# EAGLE design LME49810_Datasheet_DIYAudio (EAGLE 5.07)
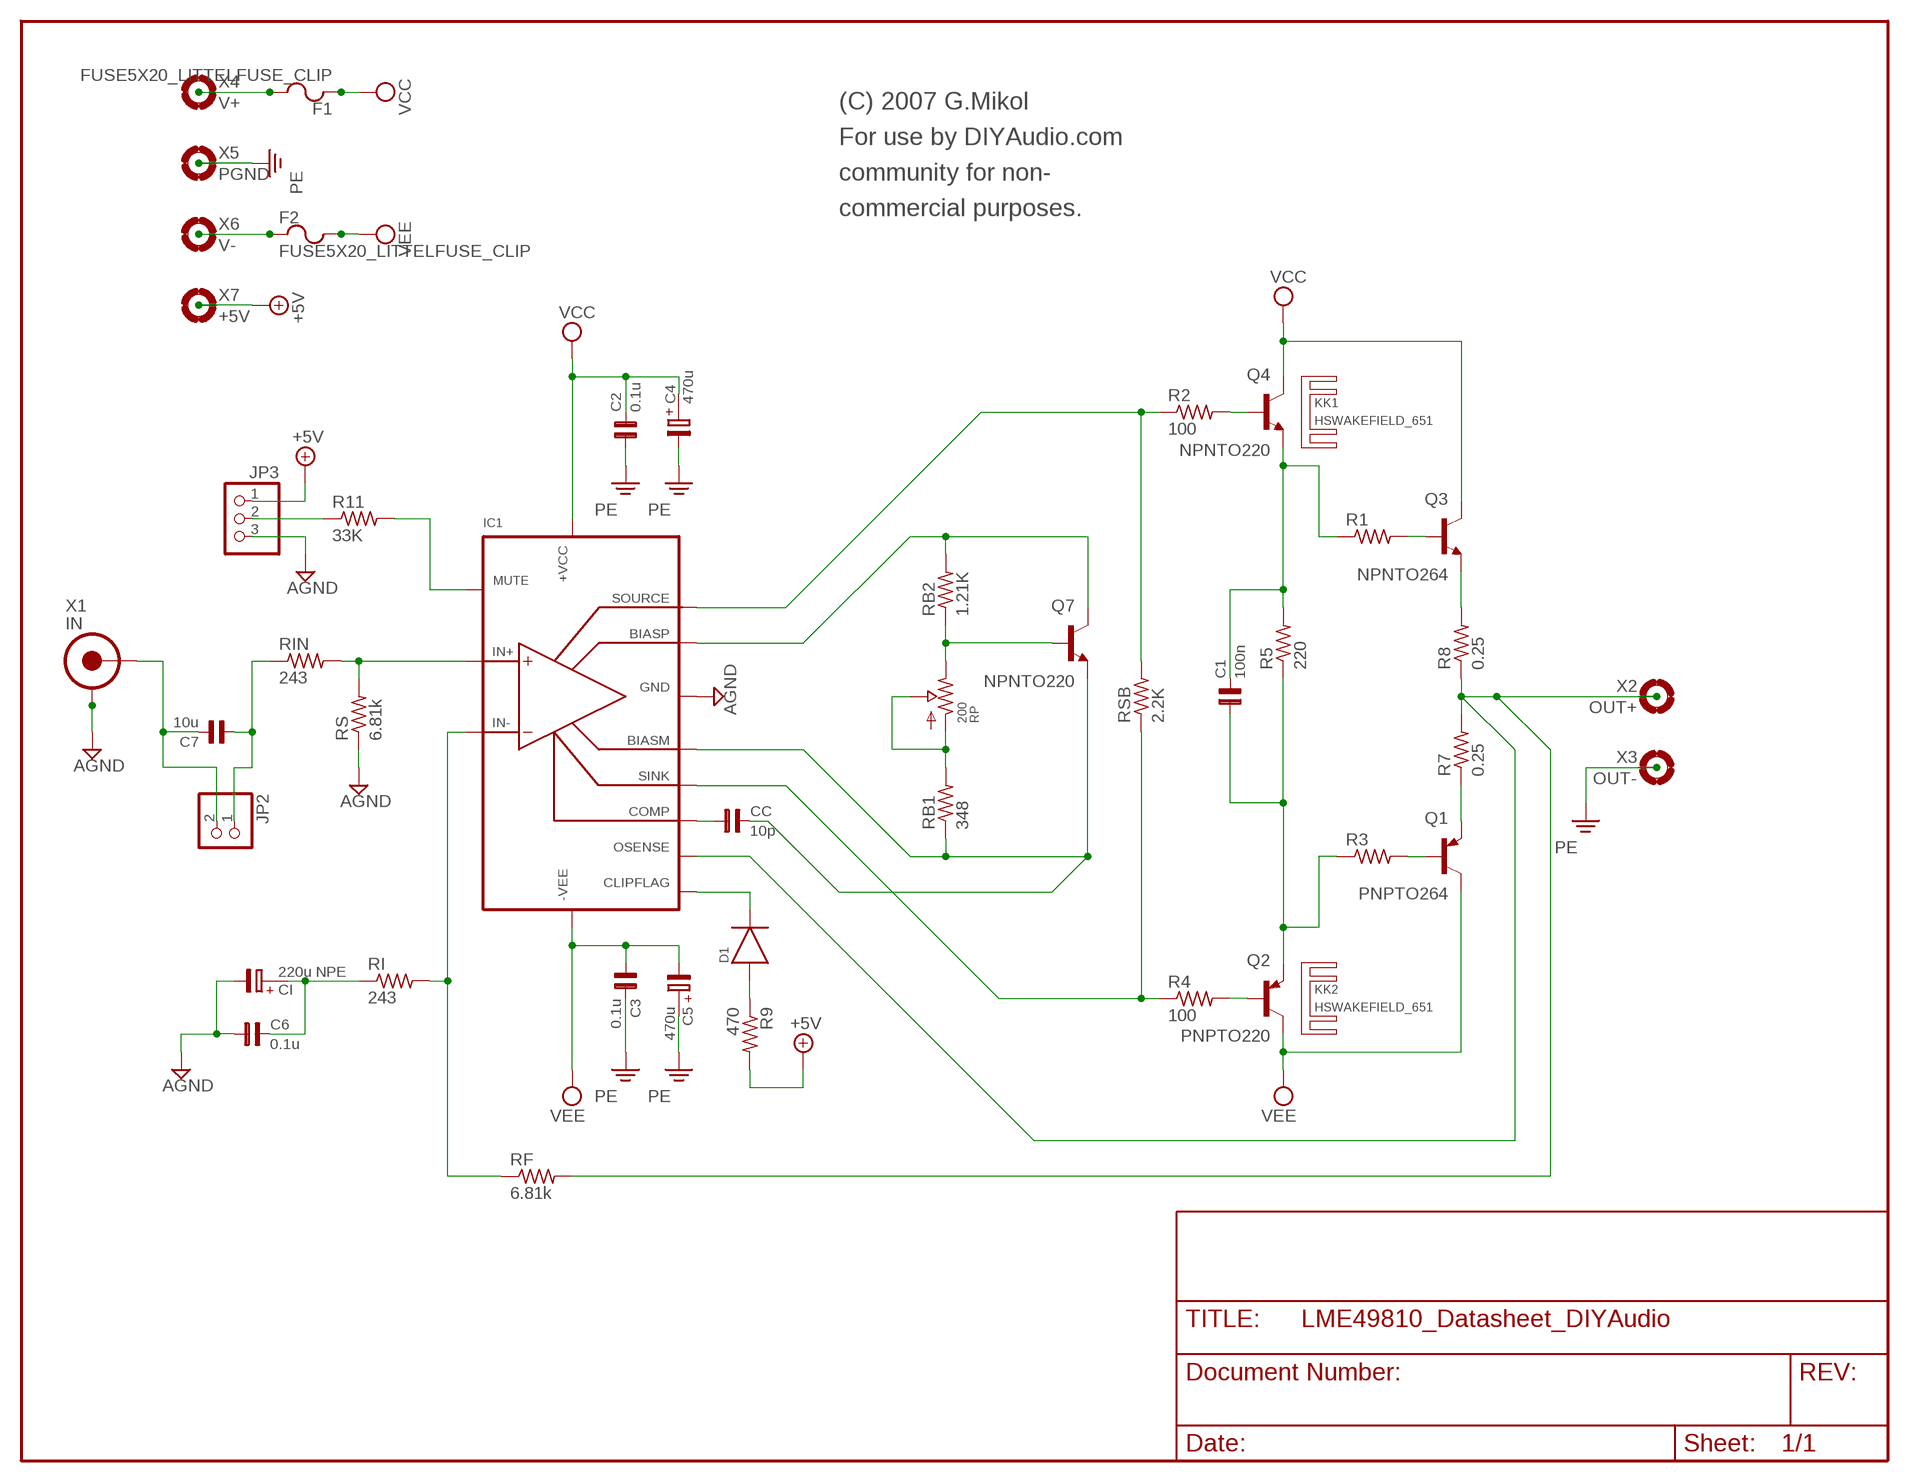
[diagram p0: schematic, sheet 1]

## Parts
C1  100n  CFB  [PAN_BSERIES]
C2  0.1u  CFB  [PAN_BSERIES]
C3  0.1u  CFB  [PAN_BSERIES]
C4  470u  CE1500U_50V_FC  [PAN_FC_1500U_50V]
C5  470u  CE1500U_50V_FC  [PAN_FC_1500U_50V]
C6  0.1u  CFB  [PAN_BSERIES]
C7  10u  CFE10U  [PAN_EFSERIES_10UF]
CC  10p  CFB  [PAN_BSERIES]
CI  220u NPE  CE470U_FC  [PAN_FC_470U_25V]
D1  1N4001  [DO41-10]
F1  FUSE5X20_LITTELFUSE_CLIP  [LITTELFUSE_5X20_CLIP]
F2  FUSE5X20_LITTELFUSE_CLIP  [LITTELFUSE_5X20_CLIP]
IC1  LME49810TB  [LME49810]
JP2  PINHD-1X2  [1X02]
JP3  PINHD-1X3  [1X03]
KK1  HSWAKEFIELD_651  [WAKEFIELD_651]
KK2  HSWAKEFIELD_651  [WAKEFIELD_651]
Q1  PNPTO264  [TO264]
Q2  PNPTO220  [TO220S]
Q3  NPNTO264  [TO264]
Q4  NPNTO220  [TO220S]
Q7  NPNTO220  [TO220S]
R1  RESQWATT  [RESQW]
R2  100  RESQWATT  [RESQW]
R3  RESQWATT  [RESQW]
R4  100  RESQWATT  [RESQW]
R5  220  RESEWATT  [RESEW]
R7  0.25  RES5WATTV  [RES5WV]
R8  0.25  RES5WATTV  [RES5WV]
R9  470  RESEWATT  [RESEW]
R11  33K  RESEWATT  [RESEW]
RB1  348  RESEWATT  [RESEW]
RB2  1.21K  RESEWATT  [RESEW]
RF  6.81k  RESEWATT  [RESEW]
RI  243  RESEWATT  [RESEW]
RIN  243  RESEWATT  [RESEW]
RP  200  POT  [OFFBOARD]
RS  6.81k  RESEWATT  [RESEW]
RSB  2.2K  RESEWATT  [RESEW]
X1  IN  RCAEDGE  [RCA_EDGE]
X2  OUT+  FASTON0_250  [FASTON_250]
X3  OUT-  FASTON0_250  [FASTON_250]
X4  V+  FASTON0_250  [FASTON_250]
X5  PGND  FASTON0_250  [FASTON_250]
X6  V-  FASTON0_250  [FASTON_250]
X7  +5V  FASTON0_250  [FASTON_250]

## Nets
+5V: JP3.1 R9.2 X7.P$1 X7.P$2
AGND: C6.1 CI.- IC1.3(GND) JP3.3 RS.1 X1.SHELL@1(SHELL) X1.SHELL@2(SHELL) X1.SHELL@3(SHELL)
N$1: Q3.1(B) R1.2
N$2: C1.2 Q4.3(E) R1.1 R5.2
N$3: Q4.1(B) R2.2
N$4: Q1.1(B) R3.2
N$5: C1.1 Q2.3(E) R3.1 R5.1
N$6: Q2.1(B) R4.2
N$7: IC1.8(OSENSE) R7.2 R8.1 RF.2 X2.P$1 X2.P$2
N$8: Q3.3(E) R8.2
N$9: Q1.3(E) R7.1
N$10: F1.2A F1.2B X4.P$1 X4.P$2
N$11: F2.1A F2.1B X6.P$1 X6.P$2
N$13: RB1.2 RP.1 RP.2
N$16: Q7.1(B) RB2.1 RP.3
N$17: CC.2 IC1.11(BIASM) Q7.3(E) RB1.1
N$18: IC1.12(BIASP) Q7.2(C) RB2.2
N$19: IC1.14(SOURCE) R2.1 RSB.2
N$20: IC1.13(SINK) R4.1 RSB.1
N$21: IC1.5(-IN) RF.1 RI.2
N$22: C6.2 CI.+ RI.1
N$23: CC.1 IC1.6(COMP)
N$24: C7.2 JP2.2 X1.COND
N$26: IC1.4(+IN) RIN.2 RS.2
N$27: C7.1 JP2.1 RIN.1
N$28: JP3.2 R11.1
N$29: IC1.2(MUTE) R11.2
N$30: D1.A R9.1
N$31: D1.C IC1.1(CLIPFLAG)
PE: C2.1 C3.2 C4.- C5.+ X3.P$1 X3.P$2 X5.P$1 X5.P$2
VCC: C2.2 C4.+ F1.1A F1.1B IC1.15(VCC) Q3.2(C) Q4.2(C)
VEE: C3.1 C5.- F2.2A F2.2B IC1.10(VEE) Q1.2(C) Q2.2(C)

## Notes on the sheet
- (C) 2007 G.Mikol
- For use by DIYAudio.com
- community for non-
- commercial purposes.

## Library data of the parts
C1-C3 C6 C7 CC = greg_diy:CF
C4 C5 CI = greg_diy:CE
D1 = greg_diy:1N4001: DIODE general purpose rectifier, 1 A, 50V
F1 F2 = greg_diy:FUSE
IC1 = greg_diy:LME49810
JP2 = pinhead_diy:PINHD-1X2: PIN HEADER
JP3 = pinhead_diy:PINHD-1X3: PIN HEADER
KK1 KK2 = greg_diy:HS: HEATSINK manufacturer Fischer/distributor Buerklin
Q1 Q2 = greg_diy:PNP: PNP Transistor
Q3 Q4 Q7 = greg_diy:NPN: NPN Transistor
R1-R5 R7-R9 R11 RB1 RB2 RF RI RIN RS RSB = greg_diy:RES
RP = greg_diy:POT: POTENTIOMETER
X1 = greg_diy:RCA
X2-X7 = greg_diy:FASTON

## Board
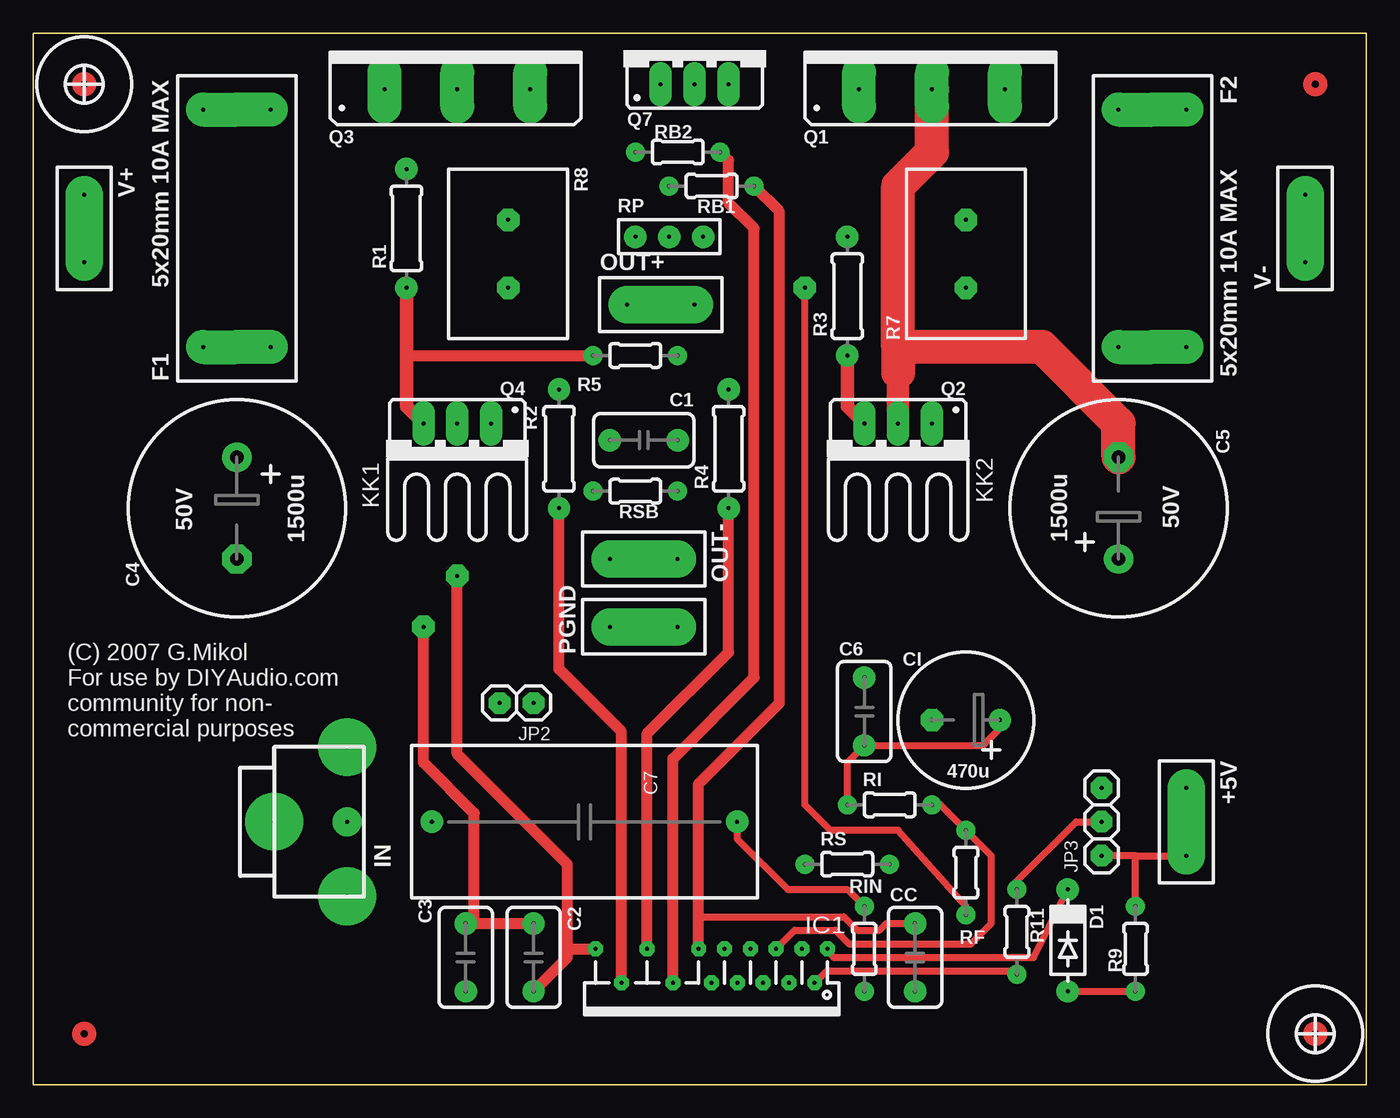
[diagram p1: board, top side]
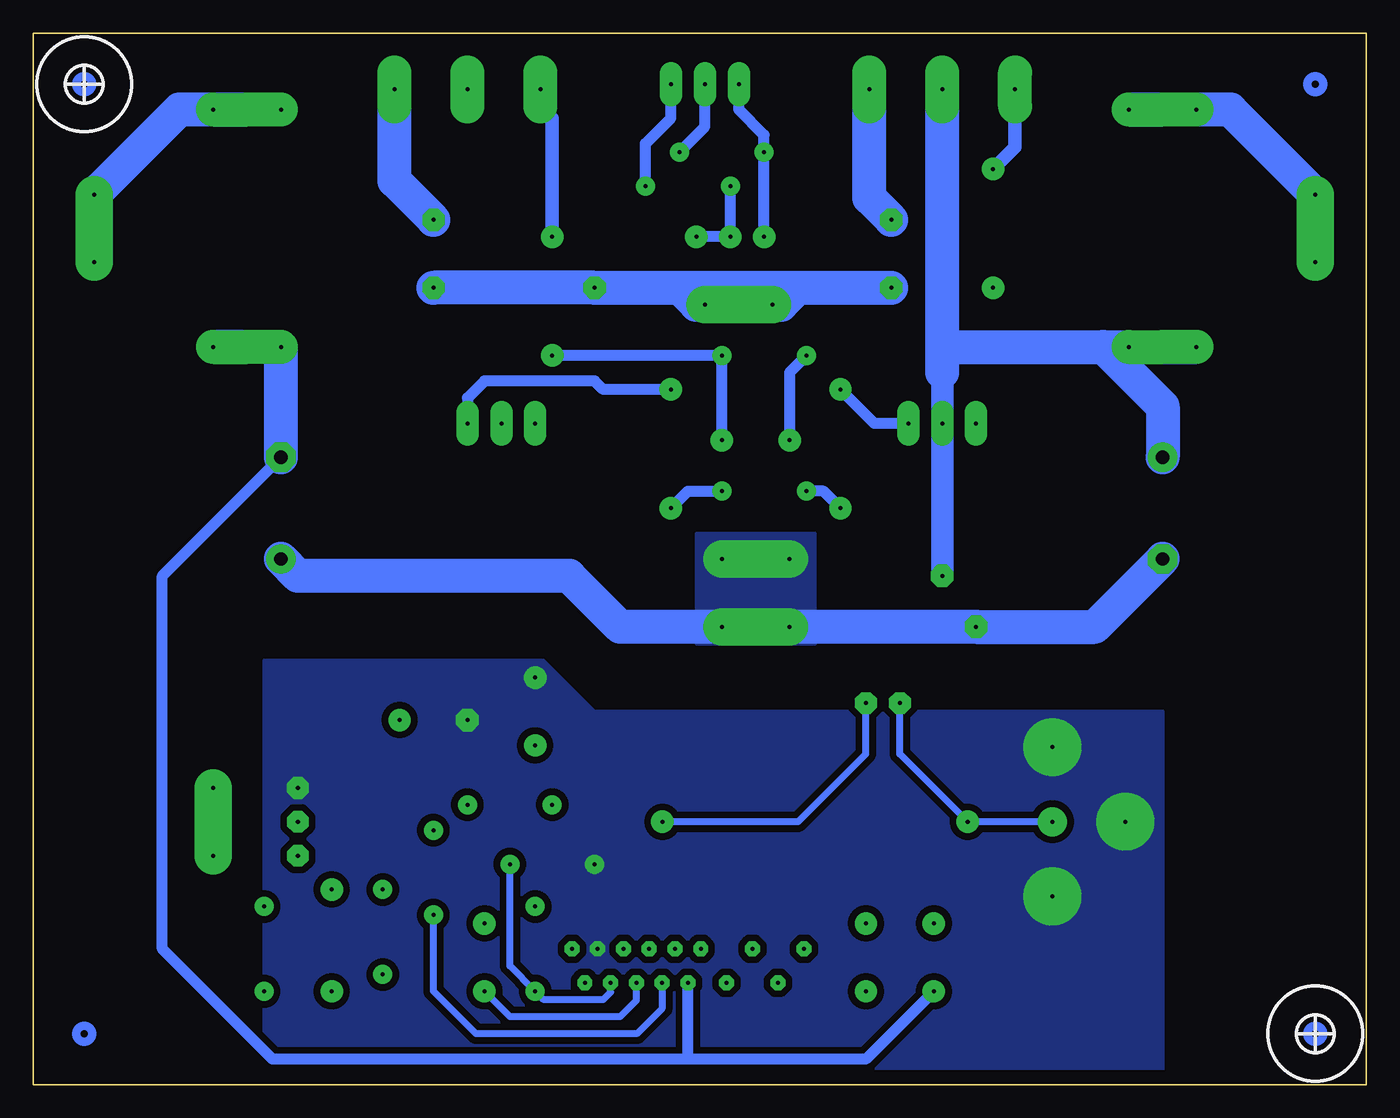
[diagram p2: board, bottom side, seen from below]

Size 99.82 x 78.74 mm. Coordinates in mm from the lower left corner, seen from the top.
Outline: 0,0 99.82,0 99.82,78.74 0,78.74 0,0
Copper layers (1*16): Top 0.035mm / dielectric 1.5mm / Bottom 0.035mm
Design rules "Olimex_10mils": minimum track width 10mil, minimum drill 24mil, track to track 10mil, track to pad 10mil, pad to pad 10mil, via to via 10mil, smd to smd 10mil, copper to edge 40mil, drill to drill 10mil, minimum pad ring 10mil, minimum via ring 8mil, stop-mask expansion 0mil, vias tented up to drill 0mil, thermal gap 10mil

### Footprints (pad centres in the part's own frame; a part is rotated, then mirrored left to right if it is on the bottom)
PAN_BSERIES = drill 0.3 pad 1.676 round: 1 -2.54,0; 2 2.54,0
PAN_FC_1500U_50V = drill 1 pad 2.184 round: + -3.81,0 | drill 1 pad 2.184 octagon: - 3.81,0
PAN_EFSERIES_10UF = drill 0.3 pad 1.676 round: 1 -11.43,0; 2 11.43,0
PAN_FC_470U_25V = drill 0.3 pad 1.676 round: + -2.54,0 | drill 0.3 pad 1.676 octagon: - 2.54,0
DO41-10 = drill 0.3 pad 1.676 round: A 3.81,0; C -3.81,0
LITTELFUSE_5X20_CLIP = drill 0.3 pad 2.54 offset: 1A -8.89,2.54; 1B -8.89,-2.54; 2A 8.89,2.54; 2B 8.89,-2.54
LME49810 = drill 0.3 pad 1.118 octagon: 1 -8.685,0; 2 -7.72,2.54; 3 -6.755,0; 4 -5.79,2.54; 5 -4.825,0; 6 -3.86,2.54; 7 -2.895,0; 8 -1.93,2.54; 9 -0.965,0; 10 0,2.54; 11 0.965,0; 12 2.895,2.54; 13 4.825,0; 14 6.755,2.54; 15 8.685,0
1X02 = drill 0.3 pad 1.626 octagon: 1 -1.27,0; 2 1.27,0
1X03 = drill 0.3 pad 1.626 octagon: 1 -2.54,0; 2 0,0; 3 2.54,0
TO264 = drill 0.3 pad 2.54 long: 1 -5.461,-2.921; 2 0,-2.921; 3 5.461,-2.921
TO220S = drill 0.3 pad 1.676 long: 1 -2.54,-2.54; 2 0,-2.54; 3 2.54,-2.54
RESQW = drill 0.3 pad 1.676 round: 1 -3.81,0; 2 5.08,0
RESEW = drill 0.3 pad 1.422 round: 1 -3.81,0; 2 2.54,0
RES5WV = drill 0.3 pad 1.676 octagon: 1 -2.54,0; 2 2.54,0
OFFBOARD = drill 0.3 pad 1.676 round: 1 -2.54,0; 2 0,0; 3 2.54,0
RCA_EDGE = drill 0.3 pad 2.184 round: COND -1.27,0 | drill 0.3 pad 4.318 round: SHELL@1 -1.27,5.588; SHELL@2 -1.27,-5.588; SHELL@3 -6.731,0
FASTON_250 = drill 0.3 pad 2.794 offset: P$1 -2.54,0; P$2 2.54,0

### Placement (x,y rotation side)
C1  45.72,48.26 180 top
C2  37.47,9.53 270 top
C3  32.38,9.53 90 top
C4  15.24,43.18 270 top
C5  81.28,43.18 90 top
C6  62.23,27.94 270 top
C7  41.27,19.68 180 top
CC  66.04,9.53 90 top
CI  69.85,27.3 180 top
D1  77.47,10.79 270 top
F1  15.24,64.14 90 top
F2  83.82,64.14 270 top
IC1  50.8,10.16 180 top
JP2  36.2,28.57 180 top
JP3  80.01,19.68 90 top
KK1  31.75,46.99 180 top
KK2  64.77,46.99 180 top
Q1  67.31,77.47 0 top
Q2  64.77,46.99 180 top
Q3  31.75,77.47 0 top
Q4  31.75,46.99 180 top
Q7  49.53,77.47 0 top
R1  27.94,63.5 90 top
R2  39.37,46.99 90 top
R3  60.96,58.42 90 top
R4  52.07,46.99 90 top
R5  44.45,54.61 180 top
R7  69.85,62.23 270 top
R8  35.56,62.23 90 top
R9  82.55,10.79 90 top
R11  73.66,10.79 270 top
RB1  50.16,67.31 180 top
RB2  48.9,69.85 0 top
RF  69.85,15.24 270 top
RI  64.77,20.95 0 top
RIN  62.23,9.53 270 top
RP  47.62,63.5 180 top
RS  61.59,16.51 0 top
RSB  44.45,44.45 180 top
U$1  [MOUNT_4_40]  0,78.74 0 top
U$2  [MOUNT_4_40]  99.82,78.74 0 bottom
U$3  [MOUNT_4_40]  0,0 180 bottom
U$4  [MOUNT_4_40]  99.82,0 180 top
X1  24.77,19.68 0 top
X2  46.99,58.42 0 top
X3  45.72,39.37 180 top
X4  3.81,64.14 270 top
X5  45.72,34.29 0 top
X6  95.25,64.14 90 top
X7  86.36,19.68 270 top

### Tracks (layer width: path | path; a pad name or v marks a point on that pad's centre or on a via)
+5V
  Top 0.508: X7.P$1 X7.P$2 82.55,17.14 | 82.55,17.14 JP3.1 | R9.2 82.55,17.14
AGND
  pour Bottom (isolate 0.508, no thermals): 15.24,0 15.24,27.94 57.78,27.94 61.59,31.75 82.55,31.75 82.55,0
N$1
  Bottom 1.016: Q3.1 26.29,70.23 R1.2
N$2
  Top 0.813: 27.94,54.61 R5.2
  Top 1.016: Q4.3 27.94,50.8 27.94,54.61 R1.1
  Bottom 0.813: R5.2 43.18,53.34 C1.2
N$3
  Bottom 0.813: Q4.1 36.83,49.53 R2.2
N$4
  Bottom 1.016: Q1.1 61.85,73.28 60.96,72.39 R3.2
N$5
  Top 1.016: Q2.3 60.96,50.8 R3.1
  Bottom 0.813: C1.1 R5.1 R3.1
N$6
  Bottom 0.813: R4.2 57.15,52.07 57.78,52.7 66.04,52.7 67.31,51.44 Q2.1
N$7  (via drill 0.3 pad 1.68)
  Top 0.508: RF.2 69.85,13.34 64.77,19.05 59.69,19.05 57.78,20.95 v57.78,59.69
  Bottom 0.508: IC1.8 52.7,7.62 52.7,5.71 54.61,3.81 66.67,3.81 69.85,6.99 RF.2
  Bottom 2.54: 42.55,59.69 R8.1 | 51.44,59.69 42.55,59.69 | 51.44,59.69 v57.78,59.69 R7.2 | 51.44,59.69 50.16,58.42 X2.P$2 X2.P$1 43.81,58.42 42.55,59.69
N$8
  Bottom 2.54: Q3.3 37.21,66.42 R8.2
N$9
  Bottom 2.54: Q1.3 72.77,67.69 R7.1
N$10
  Bottom 2.54: X4.P$2 X4.P$1 10.16,73.03 F1.2A F1.2B
N$11
  Bottom 2.54: X6.P$1 X6.P$2 88.9,73.03 F2.1A F2.1B
N$13
  Bottom 0.813: RB1.2 RP.2 RP.1
N$16
  Bottom 0.813: Q7.1 46.99,73.03 45.09,71.12 RB2.1 RP.3
N$17
  Top 0.508: CC.2 63.88,12.06 63.37,11.56 61.72,11.56 60.71,12.57 49.84,12.57 49.78,12.57
  Top 0.813: RB1.1 55.88,65.41 55.88,28.57 49.84,22.53 49.84,12.57 IC1.11
  Bottom 0.813: Q7.3 52.07,72.39 53.98,70.48 RB1.1
N$18
  Top 0.813: RB2.2 52.07,69.22 52.07,66.04 53.98,64.14 53.98,30.48 47.91,24.41 IC1.12
  Bottom 0.813: Q7.2 49.53,71.75 RB2.2
N$19
  Top 0.813: R2.1 39.37,31.11 44.05,26.44 IC1.14
  Bottom 0.813: RSB.2 40.64,44.45 R2.1
N$20
  Top 0.813: R4.1 52.07,32.38 45.98,26.29 IC1.13
  Bottom 0.813: RSB.1 50.8,44.45 R4.1
N$21
  Top 0.508: IC1.5 57.02,11.56 60.07,11.56 61.09,10.54 64.14,10.54 64.26,10.54 70.23,10.54 71.75,12.06 71.75,17.14 RF.1 67.94,20.95 RI.2
N$22
  Top 0.508: CI.+ 72.39,26.67 71.12,25.4 C6.2 60.96,24.13 RI.1
N$23
  Bottom 0.508: IC1.6 54.66,6.3 55.88,5.08 64.14,5.08 CC.1
N$24
  Bottom 0.508: JP2.2 34.92,24.77 C7.2 X1.COND
N$26
  Bottom 0.508: IC1.4 56.59,6.91 57.15,6.35 61.59,6.35 RIN.2 64.14,8.89 RS.2
N$27
  Top 0.508: RIN.1 60.96,14.61 56.52,14.61 52.7,18.41 C7.1
  Bottom 0.508: JP2.1 37.47,24.77 42.55,19.68 C7.1
N$28
  Top 0.508: R11.1 73.66,15.24 78.11,19.68 JP3.2
N$29
  Top 0.508: 58.55,7.62 59.44,8.51 73.41,8.51 R11.2
  Top 0.61: IC1.2 58.55,7.62
N$30
  Top 0.508: D1.A R9.1
N$31
  Top 0.508: IC1.1 59.48,9.98 59.94,9.53 74.93,9.53 D1.C
PE  (via drill 0.3 pad 1.68)
  Top 0.813: v29.21,34.29 29.21,24.13 33.02,20.32 33.02,12.06 | C3.2 33.02,12.06 | 33.02,12.06 C2.1
  Bottom 2.54: C5.+ 80.01,38.1 59.69,38.1 55.88,34.29 X5.P$2 X5.P$1 v29.21,34.29 20.32,34.29 C4.-
  pour Bottom (isolate 0.508, no thermals): 41.27,41.27 41.27,33.02 50.16,33.02 50.16,41.27
VCC  (via drill 0.3 pad 1.68)
  Top 0.813: v31.75,38.1 31.75,24.77 40.01,16.51 40.01,10.16 | C2.2 40.01,9.53 40.01,10.16 | 40.01,10.16 IC1.15
  Bottom 1.676: 31.75,53.34 Q4.2 v31.75,38.1
  Bottom 2.54: 31.75,74.93 Q3.2 31.75,55.24 | 31.75,53.34 31.75,55.24 | C4.+ 15.24,50.8 19.68,55.24 | 31.75,55.24 19.68,55.24 | F1.1A F1.1B 19.68,55.24
VEE
  Top 1.676: 64.77,53.34 Q2.2
  Top 2.54: 64.77,55.24 64.77,53.34 | 64.77,55.24 64.77,67.31 67.31,69.85 Q1.2 | 64.77,55.24 75.56,55.24 81.28,49.53 C5.-
  Bottom 0.813: C3.1 37.47,1.91 50.8,1.91 | 50.8,1.91 IC1.10 | 50.8,1.91 81.92,1.91 90.17,10.16 90.17,38.1 C5.-
  Bottom 2.54: F2.2A F2.2B C5.-

### Text on the board
tPlace: (C) 2007 G.Mikol | For use by DIYAudio.com | community for non- | commercial purposes